# Altium schematic sheet Sheet1.SchDoc
size A4; SheetNumber: 1; SheetTotal: 1
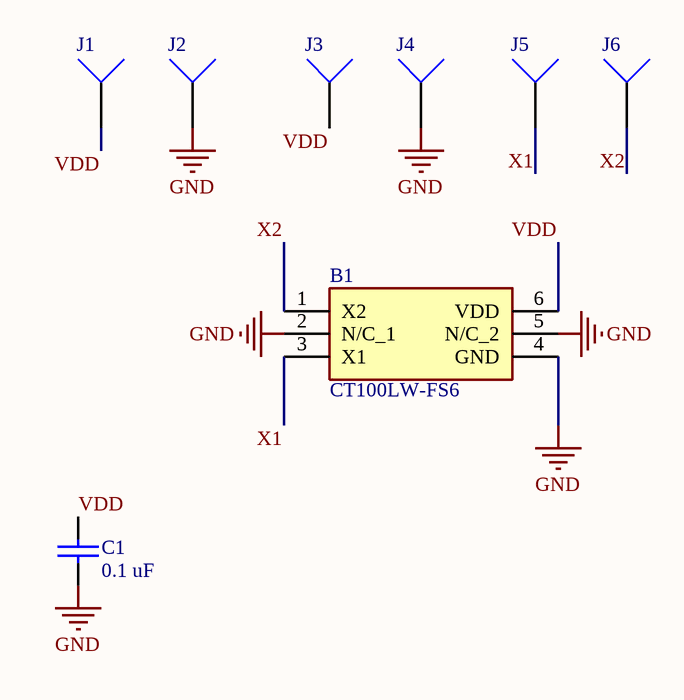
[diagram p0: Sheet1.SchDoc]

## Parts
B1  CT100LW-FS6  [SOT95P280X135-6N]
C1  0.1 uF  [ece-RAD0.2]
J1  Test pin  [ece-HDR1]  (value not drawn)
J2  Test pin  [ece-HDR1]  (value not drawn)
J3  Test pin  [ece-HDR1]  (value not drawn)
J4  Test pin  [ece-HDR1]  (value not drawn)
J5  Test pin  [ece-HDR1]  (value not drawn)
J6  Test pin  [ece-HDR1]  (value not drawn)

## Nets
GND: B1.2(N/C_1) B1.4(GND) B1.5(N/C_2) C1.2 J2.1 J4.1
VDD: B1.6(VDD) C1.1 J1.1 J3.1
X1: B1.3(X1) J5.1
X2: B1.1(X2) J6.1

## Library data of the parts
B1 = CT100LW-FS6: Board Mount Hall Effect / Magnetic Sensors Differential TMR High Sensitivity Magnetic 1D Linear  Sensor ,SOT23 - 6 pin Package, F-Temp; Manufacturer_Name: Allegro Microsystems; Geometry.Height: 1.35mm; Mouser Part Number: *; Mouser Price/Stock: *; Manufacturer_Part_Number: CT100LW-FS6; Datasheet Link: *
C1 = CAP: Capacitor Non Polarised Through Hole; Value: 0.1 uF
J1-J6 = Test pin: Socket; LatestRevisionDate: 17-Jul-2002; LatestRevisionNote: Re-released for DXP Platform.; Publisher: Altium Limited